# EAGLE schematic input_board (EAGLE 7.4.0)
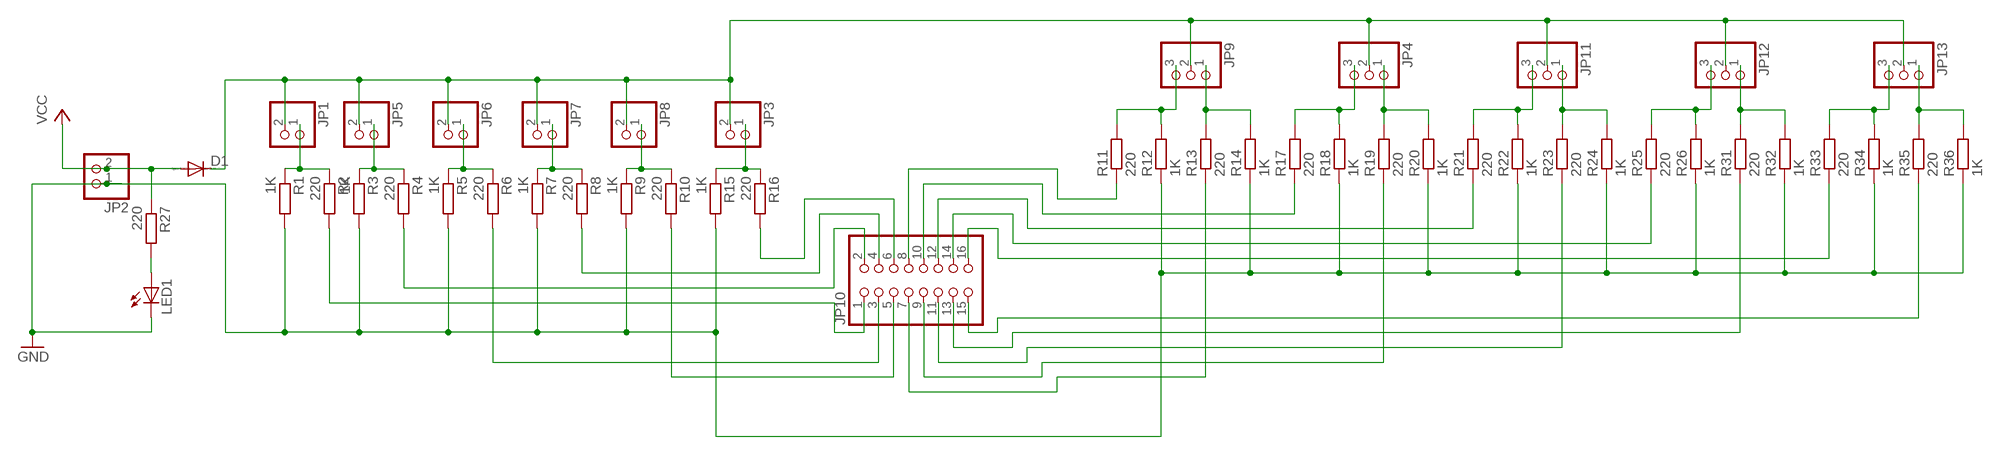
[diagram p0: schematic, sheet 1]

## Parts
D1  DIODE-C1702-05  [C1702-05]
JP1  PINHD-1X2  [1X02]
JP2  PINHD-1X2  [1X02]
JP3  PINHD-1X2  [1X02]
JP4  PINHD-1X3  [1X03]
JP5  PINHD-1X2  [1X02]
JP6  PINHD-1X2  [1X02]
JP7  PINHD-1X2  [1X02]
JP8  PINHD-1X2  [1X02]
JP9  PINHD-1X3  [1X03]
JP10  PINHD-2X8  [2X08]
JP11  PINHD-1X3  [1X03]
JP12  PINHD-1X3  [1X03]
JP13  PINHD-1X3  [1X03]
LED1  LED3MM  [LED3MM]
R1  1K  R-EU_0204/2V  [0204V]
R2  220  R-EU_0204/2V  [0204V]
R3  1K  R-EU_0204/2V  [0204V]
R4  220  R-EU_0204/2V  [0204V]
R5  1K  R-EU_0204/2V  [0204V]
R6  220  R-EU_0204/2V  [0204V]
R7  1K  R-EU_0204/2V  [0204V]
R8  220  R-EU_0204/2V  [0204V]
R9  1K  R-EU_0204/2V  [0204V]
R10  220  R-EU_0204/2V  [0204V]
R11  220  R-EU_0204/2V  [0204V]
R12  1K  R-EU_0204/2V  [0204V]
R13  220  R-EU_0204/2V  [0204V]
R14  1K  R-EU_0204/2V  [0204V]
R15  1K  R-EU_0204/2V  [0204V]
R16  220  R-EU_0204/2V  [0204V]
R17  220  R-EU_0204/2V  [0204V]
R18  1K  R-EU_0204/2V  [0204V]
R19  220  R-EU_0204/2V  [0204V]
R20  1K  R-EU_0204/2V  [0204V]
R21  220  R-EU_0204/2V  [0204V]
R22  1K  R-EU_0204/2V  [0204V]
R23  220  R-EU_0204/2V  [0204V]
R24  1K  R-EU_0204/2V  [0204V]
R25  220  R-EU_0204/2V  [0204V]
R26  1K  R-EU_0204/2V  [0204V]
R27  220  R-EU_0204/2V  [0204V]
R31  220  R-EU_0204/2V  [0204V]
R32  1K  R-EU_0204/2V  [0204V]
R33  220  R-EU_0204/2V  [0204V]
R34  1K  R-EU_0204/2V  [0204V]
R35  220  R-EU_0204/2V  [0204V]
R36  1K  R-EU_0204/2V  [0204V]

## Nets
GND: JP2.1 LED1.K(C) R1.2 R3.2 R5.2 R7.2 R9.2 R12.1 R14.1 R15.2 R18.1 R20.1 R22.1 R24.1 R26.1 R32.1 R34.1 R36.1
N$1: JP1.1 R1.1 R2.1
N$2: JP3.1 R15.1 R16.1
N$3: JP10.16 R33.1
N$4: JP5.1 R3.1 R4.1
N$5: JP6.1 R5.1 R6.1
N$6: JP7.1 R7.1 R8.1
N$7: JP8.1 R9.1 R10.1
N$8: JP10.1 R2.2
N$9: JP10.2 R4.2
N$10: JP10.3 R6.2
N$11: JP10.4 R8.2
N$12: JP10.5 R10.2
N$13: JP10.6 R16.2
N$14: JP9.3 R11.2 R12.2
N$15: JP9.1 R13.2 R14.2
N$16: JP10.14 R25.1
N$17: JP4.3 R17.2 R18.2
N$18: JP4.1 R19.2 R20.2
N$19: JP11.3 R21.2 R22.2
N$20: JP11.1 R23.2 R24.2
N$21: JP12.3 R25.2 R26.2
N$22: JP12.1 R31.2 R32.2
N$23: JP13.3 R33.2 R34.2
N$24: JP13.1 R35.2 R36.2
N$25: JP10.12 R21.1
N$26: JP10.10 R17.1
N$27: JP10.8 R11.1
N$28: JP10.15 R35.1
N$29: JP10.13 R31.1
N$30: JP10.11 R23.1
N$31: JP10.9 R19.1
N$32: JP10.7 R13.1
N$33: LED1.A R27.2
N$35: D1.C JP1.2 JP3.2 JP4.2 JP5.2 JP6.2 JP7.2 JP8.2 JP9.2 JP11.2 JP12.2 JP13.2
VCC: D1.A JP2.2 R27.1

## Library data of the parts
D1 = diode:DIODE-: DIODE
JP1-JP3 JP5-JP8 = pinhead:PINHD-1X2: PIN HEADER
JP4 JP9 JP11-JP13 = pinhead:PINHD-1X3: PIN HEADER
JP10 = pinhead:PINHD-2X8: PIN HEADER
LED1 = led:LED: LED OSRAM: - CHIPLED LG R971, LG N971, LY N971, LG Q971, LY Q971, LO R971, LY R971 LH N974, LH R974 LS Q976, LO Q976, LY Q976 LO Q996 - Hyper CHIPLED LW Q18S LB Q993, LB Q99A, LB R99A - SideLED LS A670, LO A670, LY A670, LG A670, LP A670 LB A673, LV A673, LT A673, LW A673 LH A674 LY A675 LS A676, LA A676, LO A676, LY A676, LW A676 LS A679, LY A679, LG A679 - Hyper Micro SIDELED® LS Y876, LA Y876, LO Y876, LY Y876 LT Y87S - SmartLED LW L88C, LW L88S LB L89C, LB L89S, LG L890 LS L89K, LO L89K, LY L89K LS L896, LA L896, LO L896, LY L896 - TOPLED LS T670, LO T670, LY T670, LG T670, LP T670 LSG T670, LSP T670, LSY T670, LOP T670, LYG T670 LG T671, LOG T671, LSG T671 LB T673, LV T673, LT T673, LW T673 LH T674 LS T676, LA T676, LO T676, LY T676, LB T676, LH T676, LSB T676, LW T676 LB T67C, LV T67C, LT T67C, LS T67K, LO T67K, LY T67K, LW E67C LS E67B, LA E67B, LO E67B, LY E67B, LB E67C, LV E67C, LT E67C LW T67C LS T679, LY T679, LG T679 LS T770, LO T770, LY T770, LG T770, LP T770 LB T773, LV T773, LT T773, LW T773 LH T774 LS E675, LA E675, LY E675, LS T675 LS T776, LA T776, LO T776, LY T776, LB T776 LHGB T686 LT T68C, LB T68C - Hyper Mini TOPLED® LB M676 - Mini TOPLED Santana® LG M470 LS M47K, LO M47K, LY M47K Source: http://www.osram.convergy.de LUXEON: - LUMILED® LXK2-PW12-R00, LXK2-PW12-S00, LXK2-PW14-U00, LXK2-PW14-V00 LXK2-PM12-R00, LXK2-PM12-S00, LXK2-PM14-U00 LXK2-PE12-Q00, LXK2-PE12-R00, LXK2-PE12-S00, LXK2-PE14-T00, LXK2-PE14-U00 LXK2-PB12-K00, LXK2-PB12-L00, LXK2-PB12-M00, LXK2-PB14-N00, LXK2-PB14-P00, LXK2-PB14-Q00 LXK2-PR12-L00, LXK2-PR12-M00, LXK2-PR14-Q00, LXK2-PR14-R00 LXK2-PD12-Q00, LXK2-PD12-R00, LXK2-PD12-S00 LXK2-PH12-R00, LXK2-PH12-S00 LXK2-PL12-P00, LXK2-PL12-Q00, LXK2-PL12-R00 Source: www.luxeon.com KINGBRIGHT: KA-3528ASYC Source: www.kingbright.com
R1-R27 R31-R36 = resistor:R-EU_: RESISTOR, European symbol